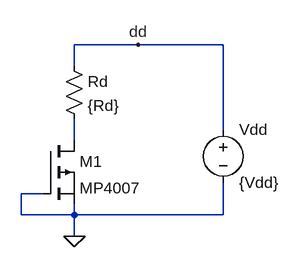
[diagram p0: schematic LAB11a1.asc]
LAB11a1.asc, the LTspice schematic file:
Version 4
SHEET 1 880 680
WIRE 304 -16 208 -16
WIRE 432 -16 304 -16
WIRE 208 16 208 -16
WIRE 432 112 432 -16
WIRE 208 128 208 96
WIRE 160 208 128 208
WIRE 128 240 128 208
WIRE 208 240 208 224
WIRE 208 240 128 240
WIRE 432 240 432 192
WIRE 432 240 208 240
WIRE 208 272 208 240
FLAG 208 272 0
FLAG 304 -16 dd
SYMBOL pmos 160 128 R0
SYMATTR InstName M1
SYMATTR Value MP4007
SYMBOL res 192 0 R0
SYMATTR InstName Rd
SYMATTR Value {Rd}
SYMBOL voltage 432 96 R0
WINDOW 123 0 0 Left 0
WINDOW 39 0 0 Left 0
SYMATTR InstName Vdd
SYMATTR Value {Vdd}

The netlist it stands for:
* LAB11a1.asc
M1 N001 0 0 0 MP4007
Rd dd N001 {Rd}
Vdd dd 0 {Vdd}
.model NMOS NMOS
.model PMOS PMOS
.lib standard.mos
.backanno
.end